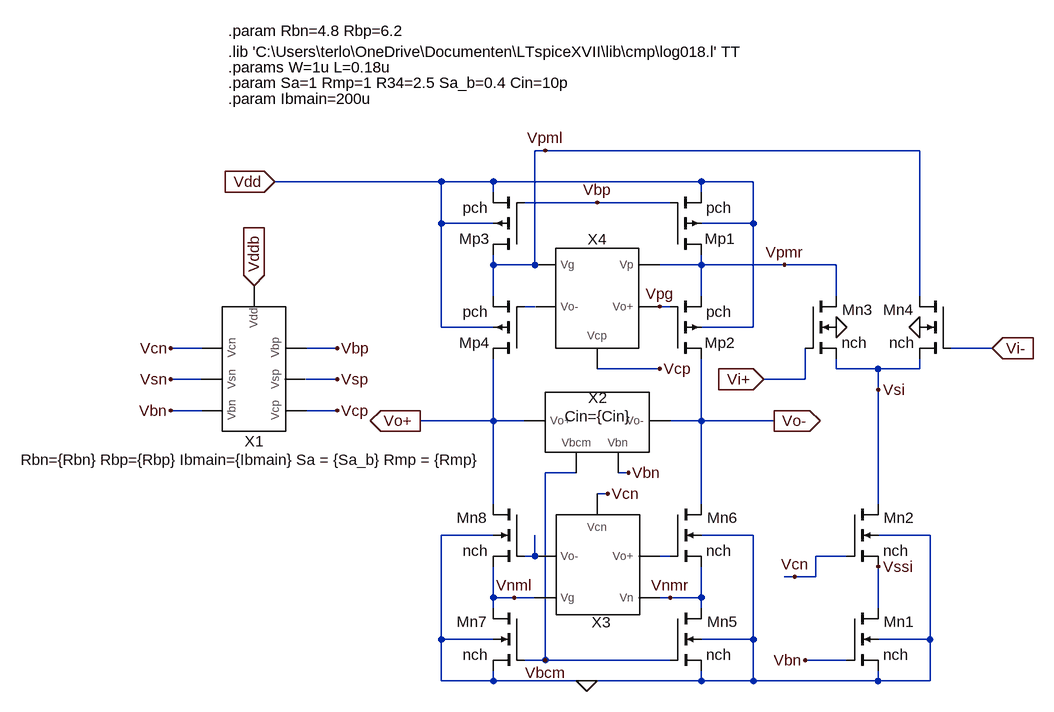
[diagram p0: schematic op_amp.asc]
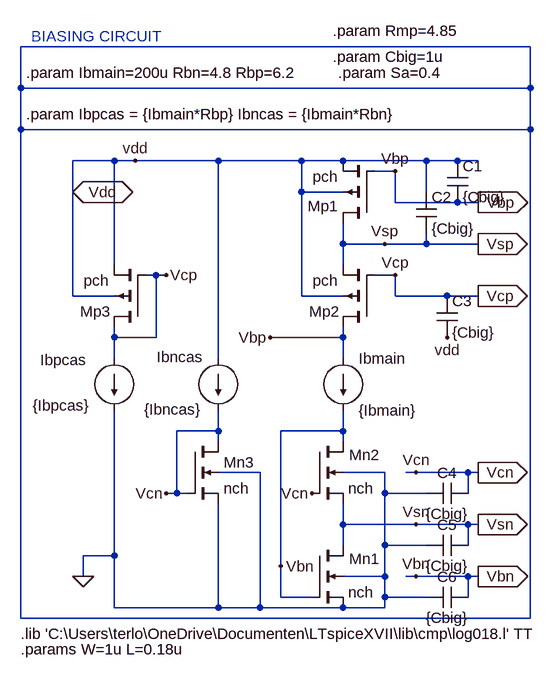
[diagram p1: sub-circuit biasing_circuit.asc]
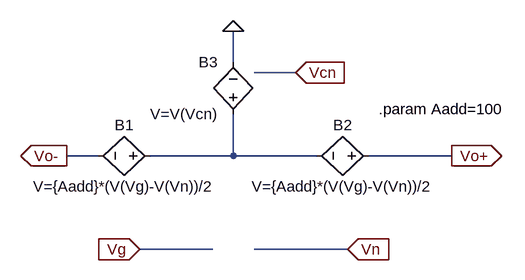
[diagram p2: sub-circuit gain_boosting_nmos.asc]
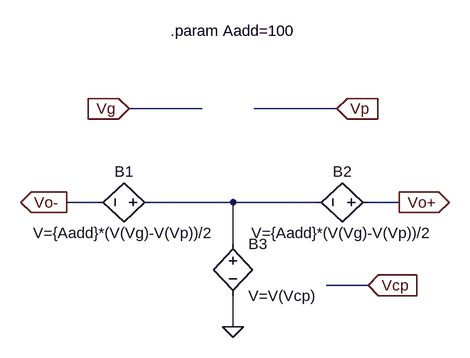
[diagram p3: sub-circuit gain_boosting_pmos.asc]
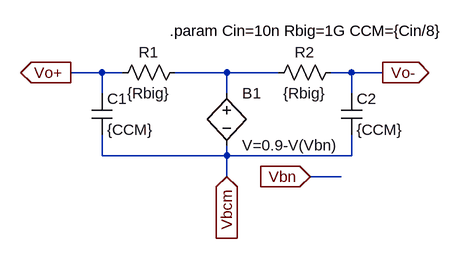
[diagram p4: sub-circuit cmfb.asc]
op_amp.asc, the LTspice schematic file:
Version 4
SHEET 1 3816 880
WIRE 1456 -96 1440 -96
WIRE 2032 -96 1456 -96
WIRE 1296 -48 1040 -48
WIRE 1376 -48 1296 -48
WIRE 1696 -48 1376 -48
WIRE 1776 -48 1696 -48
WIRE 1376 -32 1376 -48
WIRE 1696 -32 1696 -48
WIRE 1536 -16 1424 -16
WIRE 1648 -16 1536 -16
WIRE 1296 16 1296 -48
WIRE 1376 16 1296 16
WIRE 1776 16 1776 -48
WIRE 1776 16 1696 16
WIRE 1376 80 1376 64
WIRE 1440 80 1440 -96
WIRE 1440 80 1376 80
WIRE 1696 80 1696 64
WIRE 1696 80 1632 80
WIRE 1824 80 1696 80
WIRE 1904 80 1824 80
WIRE 1376 128 1376 80
WIRE 1696 128 1696 80
WIRE 1904 128 1904 80
WIRE 2032 128 2032 -96
WIRE 1440 144 1424 144
WIRE 1648 144 1632 144
WIRE 1296 176 1296 16
WIRE 1376 176 1296 176
WIRE 1776 176 1776 16
WIRE 1776 176 1696 176
WIRE 928 208 880 208
WIRE 1136 208 1088 208
WIRE 2144 208 2080 208
WIRE 1632 240 1536 240
WIRE 1904 240 1904 224
WIRE 1968 240 1904 240
WIRE 2032 240 2032 224
WIRE 2032 240 1968 240
WIRE 928 256 880 256
WIRE 1136 256 1088 256
WIRE 1856 256 1856 208
WIRE 1856 256 1792 256
WIRE 1968 272 1968 240
WIRE 928 304 880 304
WIRE 1136 304 1088 304
WIRE 1376 320 1376 224
WIRE 1376 320 1264 320
WIRE 1424 320 1376 320
WIRE 1696 320 1696 224
WIRE 1696 320 1648 320
WIRE 1808 320 1696 320
WIRE 1504 400 1456 400
WIRE 1584 400 1568 400
WIRE 1552 432 1536 432
WIRE 1376 448 1376 320
WIRE 1696 448 1696 320
WIRE 1968 448 1968 272
WIRE 1376 496 1296 496
WIRE 1776 496 1696 496
WIRE 2048 496 1968 496
WIRE 1440 528 1440 496
WIRE 1440 528 1424 528
WIRE 1648 528 1632 528
WIRE 1920 528 1872 528
WIRE 1840 560 1824 560
WIRE 1872 560 1872 528
WIRE 1872 560 1840 560
WIRE 1376 592 1376 544
WIRE 1408 592 1376 592
WIRE 1440 592 1408 592
WIRE 1648 592 1632 592
WIRE 1696 592 1696 544
WIRE 1696 592 1648 592
WIRE 1376 608 1376 592
WIRE 1696 608 1696 592
WIRE 1968 608 1968 544
WIRE 1296 656 1296 496
WIRE 1376 656 1296 656
WIRE 1776 656 1776 496
WIRE 1776 656 1696 656
WIRE 2048 656 2048 496
WIRE 2048 656 1968 656
WIRE 1456 688 1456 400
WIRE 1456 688 1424 688
WIRE 1648 688 1456 688
WIRE 1920 688 1856 688
WIRE 1296 720 1296 656
WIRE 1376 720 1376 704
WIRE 1376 720 1296 720
WIRE 1520 720 1376 720
WIRE 1696 720 1696 704
WIRE 1696 720 1520 720
WIRE 1776 720 1776 656
WIRE 1776 720 1696 720
WIRE 1968 720 1968 704
WIRE 1968 720 1776 720
WIRE 2048 720 2048 656
WIRE 2048 720 1968 720
FLAG 1040 -48 Vdd
IOPIN 1040 -48 In
FLAG 2032 176 0
FLAG 1904 176 0
FLAG 1792 256 Vi+
IOPIN 1792 256 In
FLAG 2144 208 Vi-
IOPIN 2144 208 In
FLAG 1008 112 Vddb
IOPIN 1008 112 In
FLAG 1520 720 0
FLAG 880 304 Vbn
FLAG 1584 400 Vbn
FLAG 880 208 Vcn
FLAG 1552 432 Vcn
FLAG 880 256 Vsn
FLAG 1136 208 Vbp
FLAG 1264 320 Vo+
IOPIN 1264 320 Out
FLAG 1808 320 Vo-
IOPIN 1808 320 Out
FLAG 1856 688 Vbn
FLAG 1536 -16 Vbp
FLAG 1136 304 Vcp
FLAG 1632 240 Vcp
FLAG 1136 256 Vsp
FLAG 1968 272 Vsi
FLAG 1968 544 Vssi
FLAG 1456 688 Vbcm
FLAG 1824 80 Vpmr
FLAG 1632 144 Vpg
FLAG 1408 592 Vnml
FLAG 1648 592 Vnmr
FLAG 1456 -96 Vpml
FLAG 1840 560 Vcn
DATAFLAG 1216 -48 "round($*100)/100"
DATAFLAG 1104 208 "round($*100)/100"
DATAFLAG 1104 256 "round($*100)/100"
DATAFLAG 1104 304 "round($*100)/100"
DATAFLAG 912 304 "round($*100)/100"
DATAFLAG 912 256 "round($*100)/100"
DATAFLAG 912 208 "round($*100)/100"
DATAFLAG 1328 320 "round($*100)/100"
DATAFLAG 1760 320 "round($*100)/100"
DATAFLAG 2032 32 "round($*100)/100"
DATAFLAG 1904 80 "round($*100)/100"
DATAFLAG 1872 528 "round($*100)/100"
DATAFLAG 1552 688 "round($*100)/100"
DATAFLAG 1536 432 "round($*100)/100"
DATAFLAG 1568 400 "round($*100)/100"
DATAFLAG 1968 336 "round($*100)/100"
DATAFLAG 2112 208 "round($*100)/100"
DATAFLAG 1888 688 "round($*100)/100"
DATAFLAG 1824 256 "round($*100)/100"
DATAFLAG 1968 576 "round($*100)/100"
DATAFLAG 1440 496 "round($*100)/100"
DATAFLAG 1408 80 "round($*100)/100"
DATAFLAG 1616 -16 "round($*100)/100"
DATAFLAG 1600 240 "round($*100)/100"
DATAFLAG 1440 144 "round($*100)/100"
SYMBOL pmos4 1648 224 M180
WINDOW 0 53 24 Left 2
SYMATTR InstName Mp2
SYMATTR Value pch
SYMATTR Value2 l={L} w={W} m={Sa*Rmp*2}
SYMBOL nmos4 1648 448 R0
WINDOW 0 57 21 Left 2
SYMATTR InstName Mn6
SYMATTR Value nch
SYMATTR Value2 l={L} w={W} m={Sa*2}
SYMBOL pmos4 1424 224 R180
WINDOW 0 53 24 Left 2
SYMATTR InstName Mp4
SYMATTR Value pch
SYMATTR Value2 l={L} w={W} m={Sa*Rmp*2}
SYMBOL Biasing_circuit 752 384 R90
WINDOW 39 11 -256 VBottom 2
SYMATTR SpiceLine Rbn={Rbn} Rbp={Rbp} Ibmain={Ibmain} Sa = {Sa_b} Rmp = {Rmp}
SYMATTR InstName X1
SYMBOL gain_boosting_nmos 1536 560 R0
SYMATTR InstName X3
SYMBOL gain_boosting_pmos 1536 112 R0
SYMATTR InstName X4
SYMBOL CMFB 1520 320 R0
WINDOW 39 17 8 Bottom 2
SYMATTR SpiceLine Cin={Cin}
SYMATTR InstName X2
SYMBOL pmos4 1424 64 R180
WINDOW 0 53 24 Left 2
SYMATTR InstName Mp3
SYMATTR Value pch
SYMATTR Value2 l={L} w={W} m={4*Sa*Rmp}
SYMBOL pmos4 1648 64 M180
WINDOW 0 53 24 Left 2
SYMATTR InstName Mp1
SYMATTR Value pch
SYMATTR Value2 l={L} w={W} m={4*Sa*Rmp}
SYMBOL nmos4 1424 448 M0
WINDOW 0 57 21 Left 2
SYMATTR InstName Mn8
SYMATTR Value nch
SYMATTR Value2 l={L} w={W} m={Sa*2}
SYMBOL nmos4 1648 608 R0
WINDOW 0 57 21 Left 2
SYMATTR InstName Mn5
SYMATTR Value nch
SYMATTR Value2 l={L} w={W} m={Sa*2}
SYMBOL nmos4 1424 608 M0
WINDOW 0 57 21 Left 2
SYMATTR InstName Mn7
SYMATTR Value nch
SYMATTR Value2 l={L} w={W} m={Sa*2}
SYMBOL nmos4 1920 608 R0
WINDOW 0 57 21 Left 2
SYMATTR InstName Mn1
SYMATTR Value nch
SYMATTR Value2 l={L} w={W} m={4*Sa}
SYMBOL nmos4 1920 448 R0
WINDOW 0 57 21 Left 2
SYMATTR InstName Mn2
SYMATTR Value nch
SYMATTR Value2 l={L} w={W} m={4*Sa}
SYMBOL nmos4 1856 128 R0
WINDOW 0 57 21 Left 2
SYMATTR InstName Mn3
SYMATTR Value nch
SYMATTR Value2 l={L} w={W} m={Sa*R34}
SYMBOL nmos4 2080 128 M0
WINDOW 0 57 21 Left 2
SYMATTR InstName Mn4
SYMATTR Value nch
SYMATTR Value2 l={L} w={W} m={Sa*R34}
TEXT 968 -248 Left 2 !.lib 'C:\\Users\\terlo\\OneDrive\\Documenten\\LTspiceXVII\\lib\\cmp\\log018.l' TT
TEXT 968 -224 Left 2 !.params W=1u L=0.18u
TEXT 968 -280 Left 2 !.param Rbn=4.8 Rbp=6.2
TEXT 968 -200 Left 2 !.param Sa=1 Rmp=1 R34=2.5 Sa_b=0.4 Cin=10p
TEXT 968 -176 Left 2 !.param Ibmain=200u

biasing_circuit.asc, the sub-circuit schematic file:
Version 4
SHEET 1 3816 872
WIRE 1984 -160 1200 -160
WIRE 1200 -96 1200 -160
WIRE 1984 -96 1984 -160
WIRE 1984 -96 1200 -96
WIRE 1200 -32 1200 -96
WIRE 1984 -32 1984 -96
WIRE 1984 -32 1200 -32
WIRE 1344 16 1280 16
WIRE 1376 16 1344 16
WIRE 1504 16 1376 16
WIRE 1632 16 1504 16
WIRE 1696 16 1632 16
WIRE 1824 16 1696 16
WIRE 1872 16 1824 16
WIRE 1904 16 1872 16
WIRE 1776 32 1744 32
WIRE 1280 64 1280 16
WIRE 1632 64 1632 16
WIRE 1696 64 1632 64
WIRE 1824 64 1824 16
WIRE 1776 80 1776 32
WIRE 1872 80 1776 80
WIRE 1904 80 1872 80
WIRE 1696 144 1696 112
WIRE 1760 144 1696 144
WIRE 1824 144 1824 128
WIRE 1824 144 1760 144
WIRE 1904 144 1824 144
WIRE 1344 176 1344 16
WIRE 1696 176 1696 144
WIRE 1408 192 1392 192
WIRE 1424 192 1408 192
WIRE 1776 192 1744 192
WIRE 1280 224 1280 64
WIRE 1344 224 1280 224
WIRE 1632 224 1632 64
WIRE 1696 224 1632 224
WIRE 1776 224 1776 192
WIRE 1856 224 1776 224
WIRE 1904 224 1856 224
WIRE 1344 288 1344 272
WIRE 1408 288 1408 192
WIRE 1408 288 1344 288
WIRE 1696 288 1696 272
WIRE 1696 288 1584 288
WIRE 1344 320 1344 288
WIRE 1504 320 1504 16
WIRE 1696 320 1696 288
WIRE 1504 432 1504 400
WIRE 1504 432 1440 432
WIRE 1696 432 1696 400
WIRE 1696 432 1600 432
WIRE 1504 448 1504 432
WIRE 1696 448 1696 432
WIRE 1568 496 1504 496
WIRE 1760 496 1696 496
WIRE 1808 496 1792 496
WIRE 1888 496 1808 496
WIRE 1904 496 1888 496
WIRE 1440 528 1440 432
WIRE 1440 528 1424 528
WIRE 1456 528 1440 528
WIRE 1760 528 1760 496
WIRE 1824 528 1760 528
WIRE 1888 528 1888 496
WIRE 1696 576 1696 544
WIRE 1808 576 1696 576
WIRE 1888 576 1808 576
WIRE 1904 576 1888 576
WIRE 1696 608 1696 576
WIRE 1760 608 1760 528
WIRE 1824 608 1760 608
WIRE 1888 608 1888 576
WIRE 1344 624 1344 400
WIRE 1344 624 1296 624
WIRE 1600 640 1600 432
WIRE 1296 656 1296 624
WIRE 1760 656 1760 608
WIRE 1760 656 1696 656
WIRE 1808 656 1792 656
WIRE 1888 656 1808 656
WIRE 1904 656 1888 656
WIRE 1600 688 1600 640
WIRE 1648 688 1600 688
WIRE 1760 688 1760 656
WIRE 1824 688 1760 688
WIRE 1888 688 1888 656
WIRE 1344 704 1344 624
WIRE 1504 704 1504 544
WIRE 1504 704 1344 704
WIRE 1568 704 1568 496
WIRE 1568 704 1504 704
WIRE 1696 704 1568 704
WIRE 1760 704 1760 688
WIRE 1760 704 1696 704
WIRE 1200 720 1200 -32
WIRE 1984 720 1984 -32
WIRE 1984 720 1200 720
FLAG 1376 16 vdd
FLAG 1760 144 Vsp
FLAG 1776 192 Vcp
FLAG 1776 32 Vbp
FLAG 1600 640 Vbn
FLAG 1808 656 Vbn
FLAG 1808 576 Vsn
FLAG 1808 496 Vcn
FLAG 1296 656 0
FLAG 1648 528 Vcn
FLAG 1424 528 Vcn
FLAG 1424 192 Vcp
FLAG 1584 288 Vbp
FLAG 1904 80 Vbp
IOPIN 1904 80 Out
FLAG 1904 144 Vsp
IOPIN 1904 144 Out
FLAG 1904 224 Vcp
IOPIN 1904 224 Out
FLAG 1904 496 Vcn
IOPIN 1904 496 Out
FLAG 1904 576 Vsn
IOPIN 1904 576 Out
FLAG 1904 656 Vbn
IOPIN 1904 656 Out
FLAG 1280 64 Vdd
IOPIN 1280 64 BiDir
FLAG 1856 288 vdd
DATAFLAG 1696 144 "round($*100)/100"
DATAFLAG 1792 80 "round($*100)/100"
SYMBOL nmos4 1648 448 R0
WINDOW 0 57 21 Left 2
SYMATTR InstName Mn2
SYMATTR Value nch
SYMATTR Value2 l={L} w={W} m={Sa*2}
SYMBOL current 1696 320 R0
WINDOW 123 0 0 Left 0
WINDOW 39 0 0 Left 0
SYMATTR InstName Ibmain
SYMATTR Value {Ibmain}
SYMBOL current 1504 320 R0
WINDOW 0 -95 -2 Left 2
WINDOW 3 -114 79 Left 2
WINDOW 123 0 0 Left 0
WINDOW 39 0 0 Left 0
SYMATTR InstName Ibncas
SYMATTR Value {Ibncas}
SYMBOL pmos4 1744 272 R180
WINDOW 0 53 24 Left 2
SYMATTR InstName Mp2
SYMATTR Value pch
SYMATTR Value2 l={L} w={W} m={Sa*Rmp*2}
SYMBOL pmos4 1744 112 R180
WINDOW 0 55 26 Left 2
SYMATTR InstName Mp1
SYMATTR Value pch
SYMATTR Value2 l={L} w={W} m={Sa*Rmp*2}
SYMBOL nmos4 1456 448 R0
SYMATTR InstName Mn3
SYMATTR Value nch
SYMATTR Value2 l={L} w={W} m={Sa*2}
SYMBOL current 1344 320 R0
WINDOW 0 -114 3 Left 2
WINDOW 3 -126 73 Left 2
WINDOW 123 0 0 Left 0
WINDOW 39 0 0 Left 0
SYMATTR InstName Ibpcas
SYMATTR Value {Ibpcas}
SYMBOL pmos4 1392 272 R180
WINDOW 0 53 24 Left 2
SYMATTR InstName Mp3
SYMATTR Value pch
SYMATTR Value2 l={L} w={W} m={Sa*Rmp*2}
SYMBOL nmos4 1648 608 R0
WINDOW 0 57 21 Left 2
SYMATTR InstName Mn1
SYMATTR Value nch
SYMATTR Value2 l={L} w={W} m={Sa*2}
SYMBOL cap 1856 16 R0
SYMATTR InstName C1
SYMATTR Value {Cbig}
SYMBOL cap 1808 64 R0
SYMATTR InstName C2
SYMATTR Value {Cbig}
SYMBOL cap 1840 224 R0
SYMATTR InstName C3
SYMATTR Value {Cbig}
SYMBOL cap 1824 544 R270
WINDOW 0 32 32 VTop 2
WINDOW 3 0 32 VBottom 2
SYMATTR InstName C4
SYMATTR Value {Cbig}
SYMBOL cap 1824 624 R270
WINDOW 0 32 32 VTop 2
WINDOW 3 0 32 VBottom 2
SYMATTR InstName C5
SYMATTR Value {Cbig}
SYMBOL cap 1824 704 R270
WINDOW 0 32 32 VTop 2
WINDOW 3 0 32 VBottom 2
SYMATTR InstName C6
SYMATTR Value {Cbig}
TEXT 1200 744 Left 2 !.lib 'C:\\Users\\terlo\\OneDrive\\Documenten\\LTspiceXVII\\lib\\cmp\\log018.l' TT
TEXT 1216 -176 Left 2 ;BIASING CIRCUIT
TEXT 1200 768 Left 2 !.params W=1u L=0.18u
TEXT 1208 -120 Left 2 !.param Ibmain=200u Rbn=4.8 Rbp=6.2
TEXT 1208 -56 Left 2 !.param Ibpcas = {Ibmain*Rbp} Ibncas = {Ibmain*Rbn}
TEXT 1680 -144 Left 2 !.param Cbig=1u
TEXT 1688 -120 Left 2 !.param Sa=0.4
TEXT 1680 -184 Left 2 !.param Rmp=4.85

gain_boosting_nmos.asc, the sub-circuit schematic file:
Version 4
SHEET 1 1104 680
WIRE 128 -112 128 -160
WIRE 224 -96 160 -96
WIRE -80 32 -128 32
WIRE 128 32 128 -32
WIRE 128 32 0 32
WIRE 256 32 128 32
WIRE 464 32 336 32
WIRE 96 176 -16 176
WIRE 304 176 160 176
FLAG 128 -160 0
FLAG 224 -96 Vcn
IOPIN 224 -96 In
FLAG -16 176 Vg
IOPIN -16 176 In
FLAG 304 176 Vn
IOPIN 304 176 In
FLAG -128 32 Vo-
IOPIN -128 32 Out
FLAG 464 32 Vo+
IOPIN 464 32 Out
DATAFLAG -96 32 "round($*1000)/1000"
DATAFLAG 64 176 "round($*1000)/1000"
DATAFLAG 128 32 "round($*1000)/1000"
DATAFLAG 224 176 "round($*1000)/1000"
SYMBOL bv 16 32 R90
WINDOW 0 -32 56 VBottom 2
WINDOW 3 32 56 VTop 2
SYMATTR InstName B1
SYMATTR Value V={Aadd}*(V(Vg)-V(Vn))/2
SYMBOL bv 352 32 R90
WINDOW 0 -32 56 VBottom 2
WINDOW 3 32 56 VTop 2
SYMATTR InstName B2
SYMATTR Value V={Aadd}*(V(Vg)-V(Vn))/2
SYMBOL bv 128 -16 R180
WINDOW 0 24 96 Left 2
WINDOW 3 24 16 Left 2
SYMATTR InstName B3
SYMATTR Value V=V(Vcn)
TEXT 352 -40 Left 2 !.param Aadd=100

gain_boosting_pmos.asc, the sub-circuit schematic file:
Version 4
SHEET 1 880 680
WIRE 128 48 16 48
WIRE 336 48 208 48
WIRE -32 192 -80 192
WIRE 176 192 48 192
WIRE 304 192 176 192
WIRE 432 192 384 192
WIRE 176 256 176 192
WIRE 384 320 320 320
WIRE 176 384 176 336
FLAG 176 384 0
FLAG 384 320 Vcp
IOPIN 384 320 In
FLAG 16 48 Vg
IOPIN 16 48 In
FLAG 336 48 Vp
IOPIN 336 48 In
FLAG -80 192 Vo-
IOPIN -80 192 Out
FLAG 432 192 Vo+
IOPIN 432 192 Out
DATAFLAG 272 48 "round($*1000)/1000"
DATAFLAG 80 48 "round($*1000)/1000"
DATAFLAG 128 192 "round($*1000)/1000"
DATAFLAG 400 192 "round($*1000)/1000"
DATAFLAG -64 192 "round($*1000)/1000"
SYMBOL bv 64 192 R90
WINDOW 0 -32 56 VBottom 2
WINDOW 3 32 56 VTop 2
SYMATTR InstName B1
SYMATTR Value V={Aadd}*(V(Vg)-V(Vp))/2
SYMBOL bv 400 192 R90
WINDOW 0 -32 56 VBottom 2
WINDOW 3 32 56 VTop 2
SYMATTR InstName B2
SYMATTR Value V={Aadd}*(V(Vg)-V(Vp))/2
SYMBOL bv 176 240 R0
SYMATTR InstName B3
SYMATTR Value V=V(Vcp)
TEXT 80 -72 Left 2 !.param Aadd=100

cmfb.asc, the sub-circuit schematic file:
Version 4
SHEET 1 880 680
WIRE -32 192 -80 192
WIRE 0 192 -32 192
WIRE 160 192 80 192
WIRE 240 192 160 192
WIRE 352 192 320 192
WIRE 400 192 352 192
WIRE -32 224 -32 192
WIRE 160 224 160 192
WIRE 352 224 352 192
WIRE -32 320 -32 288
WIRE 160 320 160 304
WIRE 160 320 -32 320
WIRE 352 320 352 288
WIRE 352 320 160 320
WIRE 160 352 160 320
WIRE 336 352 288 352
FLAG -80 192 Vo+
IOPIN -80 192 Out
FLAG 160 352 Vbcm
IOPIN 160 352 In
FLAG 288 352 Vbn
IOPIN 288 352 In
FLAG 400 192 Vo-
IOPIN 400 192 Out
DATAFLAG 160 192 "round($*1000)/1000"
DATAFLAG -32 192 "round($*1000)/1000"
DATAFLAG 352 192 "round($*1000)/1000"
DATAFLAG 80 320 "round($*1000)/1000"
DATAFLAG 336 352 "round($*1000)/1000"
SYMBOL res 96 176 R90
WINDOW 0 0 56 VBottom 2
WINDOW 3 32 56 VTop 2
SYMATTR InstName R1
SYMATTR Value {Rbig}
SYMBOL cap -48 224 R0
SYMATTR InstName C1
SYMATTR Value {CCM}
SYMBOL bv 160 208 R0
SYMATTR InstName B1
SYMATTR Value V=0.9-V(Vbn)
SYMBOL res 336 176 R90
WINDOW 0 0 56 VBottom 2
WINDOW 3 32 56 VTop 2
SYMATTR InstName R2
SYMATTR Value {Rbig}
SYMBOL cap 336 224 R0
SYMATTR InstName C2
SYMATTR Value {CCM}
TEXT 72 128 Left 2 !.param Cin=10n Rbig=1G CCM={Cin/8}

The netlist it stands for:
* op_amp.asc
Mp2 Vo- Vpg Vpmr Vdd pch l={L} w={W} m={Sa*Rmp*2}
Mn6 Vo- N003 Vnmr 0 nch l={L} w={W} m={Sa*2}
Mp4 Vo+ N001 Vpml Vdd pch l={L} w={W} m={Sa*Rmp*2}
XX1 Vbn Vbp Vcn Vcp Vddb Vsn Vsp biasing_circuit params: Rbn={Rbn} Rbp={Rbp} Ibmain={Ibmain} Sa = {Sa_b} Rmp = {Rmp}
XX3 Vcn Vnml Vnmr N003 N002 gain_boosting_nmos
XX4 Vcp Vpml Vpmr Vpg N001 gain_boosting_pmos
XX2 Vbcm Vbn Vo+ Vo- cmfb params: Cin={Cin}
Mp3 Vpml Vbp Vdd Vdd pch l={L} w={W} m={4*Sa*Rmp}
Mp1 Vpmr Vbp Vdd Vdd pch l={L} w={W} m={4*Sa*Rmp}
Mn8 Vo+ N002 Vnml 0 nch l={L} w={W} m={Sa*2}
Mn5 Vnmr Vbcm 0 0 nch l={L} w={W} m={Sa*2}
Mn7 Vnml Vbcm 0 0 nch l={L} w={W} m={Sa*2}
Mn1 Vssi Vbn 0 0 nch l={L} w={W} m={4*Sa}
Mn2 Vsi Vcn Vssi 0 nch l={L} w={W} m={4*Sa}
Mn3 Vpmr Vi+ Vsi 0 nch l={L} w={W} m={Sa*R34}
Mn4 Vpml Vi- Vsi 0 nch l={L} w={W} m={Sa*R34}

* block symbol definitions
.subckt biasing_circuit Vbn Vbp Vcn Vcp Vdd Vsn Vsp
Mn2 Vbn Vcn Vsn 0 nch l={L} w={W} m={Sa*2}
Ibmain Vbp Vbn {Ibmain}
Ibncas vdd Vcn {Ibncas}
Mp2 Vbp Vcp Vsp vdd pch l={L} w={W} m={Sa*Rmp*2}
Mp1 Vsp Vbp vdd vdd pch l={L} w={W} m={Sa*Rmp*2}
Mn3 Vcn Vcn 0 0 nch l={L} w={W} m={Sa*2}
Ibpcas Vcp 0 {Ibpcas}
Mp3 Vcp Vcp vdd vdd pch l={L} w={W} m={Sa*Rmp*2}
Mn1 Vsn Vbn 0 0 nch l={L} w={W} m={Sa*2}
C1 vdd Vbp {Cbig}
C2 vdd Vsp {Cbig}
C3 Vcp vdd {Cbig}
C4 0 Vcn {Cbig}
C5 0 Vsn {Cbig}
C6 0 Vbn {Cbig}
.lib 'C:\Users\terlo\OneDrive\Documenten\LTspiceXVII\lib\cmp\log018.l' TT
* BIASING CIRCUIT
.params W=1u L=0.18u
.param Ibmain=200u Rbn=4.8 Rbp=6.2
.param Ibpcas = {Ibmain*Rbp} Ibncas = {Ibmain*Rbn}
.param Cbig=1u
.param Sa=0.4
.param Rmp=4.85
.ends biasing_circuit

.subckt gain_boosting_nmos Vcn Vg Vn Vo+ Vo-
B1 N001 Vo- V={Aadd}*(V(Vg)-V(Vn))/2
B2 Vo+ N001 V={Aadd}*(V(Vg)-V(Vn))/2
B3 N001 0 V=V(Vcn)
.param Aadd=100
.ends gain_boosting_nmos

.subckt gain_boosting_pmos Vcp Vg Vp Vo+ Vo-
B1 N001 Vo- V={Aadd}*(V(Vg)-V(Vp))/2
B2 Vo+ N001 V={Aadd}*(V(Vg)-V(Vp))/2
B3 N001 0 V=V(Vcp)
.param Aadd=100
.ends gain_boosting_pmos

.subckt cmfb Vbcm Vbn Vo+ Vo-
R1 N001 Vo+ {Rbig}
C1 Vo+ Vbcm {CCM}
B1 N001 Vbcm V=0.9-V(Vbn)
R2 Vo- N001 {Rbig}
C2 Vo- Vbcm {CCM}
.param Cin=10n Rbig=1G CCM={Cin/8}
.ends cmfb

.model NMOS NMOS
.model PMOS PMOS
.lib standard.mos
.lib 'C:\Users\terlo\OneDrive\Documenten\LTspiceXVII\lib\cmp\log018.l' TT
.params W=1u L=0.18u
.param Rbn=4.8 Rbp=6.2
.param Sa=1 Rmp=1 R34=2.5 Sa_b=0.4 Cin=10p
.param Ibmain=200u
.backanno
.end